# EAGLE design xbee_inclinometer (EAGLE 9.6.2)
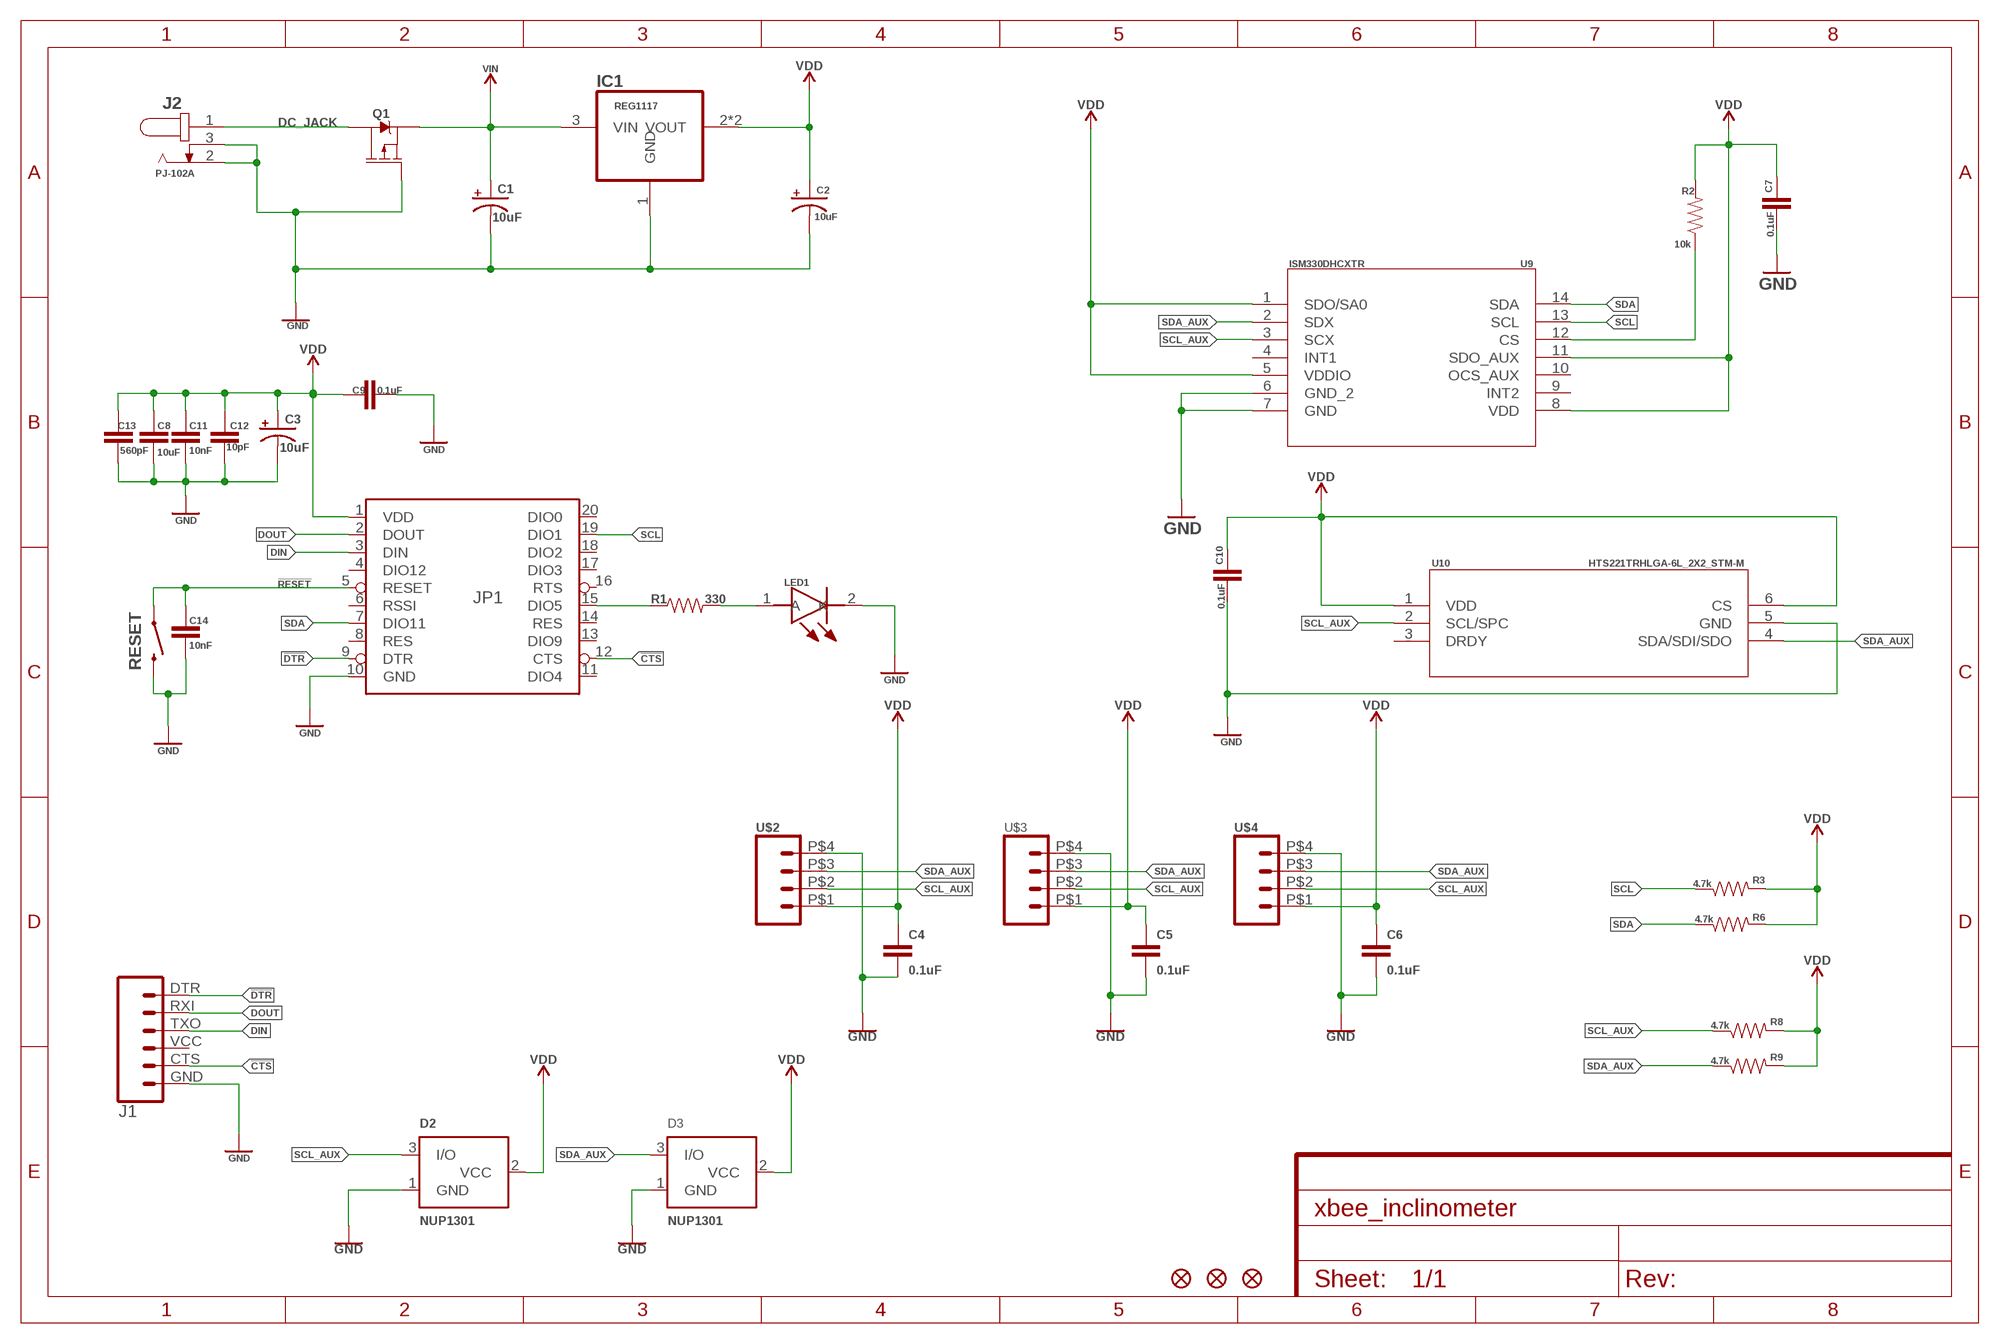
[diagram p0: schematic, sheet 1]

## Parts
C1  10uF  10UF-POLAR-EIA3216-16V-10%(TANT)  [EIA3216]
C2  10uF  10UF-POLAR-EIA3216-16V-10%(TANT)  [EIA3216]
C3  10uF  10UF-POLAR-EIA3216-16V-10%(TANT)  [EIA3216]
C4  0.1uF  0.1UF-0603-25V-(+80/-20%)  [0603]
C5  0.1uF  0.1UF-0603-25V-(+80/-20%)  [0603]
C6  0.1uF  0.1UF-0603-25V-(+80/-20%)  [0603]
C7  0.1uF  0.1UF-0603-25V-(+80/-20%)  [0603]
C8  10uF  10UF-0603-6.3V-20%  [0603]
C9  0.1uF  0.1UF-0603-25V-(+80/-20%)  [0603]
C10  0.1uF  0.1UF-0603-25V-(+80/-20%)  [0603]
C11  10nF  10NF-0603-50V-10%  [0603]
C12  10pF  10PF-0603-50V-5%  [0603]
C13  560pF  560PF-0603-50V-5%  [0603]
C14  10nF  10NF-0603-50V-10%  [0603]
D2  NUP1301  NUP1301_NUP1301  [NUP1301_SOT-23]
D3  NUP1301  NUP1301_NUP1301  [NUP1301_SOT-23]
FID1  MICROBUILDER_FIDUCIAL""  [MICROBUILDER_FIDUCIAL_1MM]
FID2  MICROBUILDER_FIDUCIAL""  [MICROBUILDER_FIDUCIAL_1MM]
FID4  MICROBUILDER_FIDUCIAL""  [MICROBUILDER_FIDUCIAL_1MM]
IC1  REG1117  [SOT223]
J1  6_PIN_SERIAL_CABLEPTH  [FTDI_BASIC]
J2  PJ-102A  [CUI_PJ-102A]
JP1  XBEESMD  [XBEE-SMD]
LED1  SMTL2-UWD  [SMTL2UWD]
Q1  2.5A/30V/105mΩ  MOSFET_PCH-DMG2307L  [SOT23-3]
R1  330  330OHM-0603-1/10W-1%  [0603]
R2  10k  10KOHM-0603-1/10W-1%  [0603]
R3  4.7k  4.7KOHM-0603-1/10W-1%  [0603]
R6  4.7k  4.7KOHM-0603-1/10W-1%  [0603]
R8  4.7k  4.7KOHM-0603-1/10W-1%  [0603]
R9  4.7k  4.7KOHM-0603-1/10W-1%  [0603]
RESET  MOMENTARY-SWITCH-SPST-PTH-6.0MM  [TACTILE_SWITCH_PTH_6.0MM]
U9  ISM330DHCXTR  [QFN_DHCXTR_STM]
U10  HTS221TRHLGA-6L_2X2_STM-M  [HLGA-6L_2X2_STM-M]
U$2  RIGHT_ANGLED_DCFRECONN  [M8_FRECONN]
U$3  RIGHT_ANGLED_DCFRECONN  [M8_FRECONN]
U$4  RIGHT_ANGLED_DCFRECONN  [M8_FRECONN]

## Nets
!CTS: J1.CTS JP1.12(CTS)
!DTR: J1.DTR JP1.9(DTR)
!RESET: C14.1 JP1.5(RESET) RESET.1
DC_JACK: J2.1 Q1.3(D)
DIN: J1.TXO JP1.3(DIN)
DOUT: J1.RXI JP1.2(DOUT)
GND: C1.- C2.- C3.- C4.2 C5.2 C6.2 C7.2 C8.2 C9.1 C10.2 C11.2 C12.2 C13.2 C14.2 D2.1(GND) D3.1(GND) IC1.1(GND) J1.GND J2.2 J2.3 JP1.10(GND) LED1.2(K) Q1.1(G) RESET.3 U9.6(GND_2) U9.7(GND) U10.5(GND) U$2.P$4(GND) U$3.P$4(GND) U$4.P$4(GND)
N$1: JP1.15(DIO5) R1.1
N$3: LED1.1(A) R1.2
N$5: R2.1 U9.12(CS)
SCL: JP1.19(DIO1) R3.1 U9.13(SCL)
SCL_AUX: D2.3(I/O) R8.1 U9.3(SCX) U10.2(SCL/SPC) U$2.P$2(SCL) U$3.P$2(SCL) U$4.P$2(SCL)
SDA: JP1.7(DIO11) R6.1 U9.14(SDA)
SDA_AUX: D3.3(I/O) R9.1 U9.2(SDX) U10.4(SDA/SDI/SDO) U$2.P$3(SDA) U$3.P$3(SDA) U$4.P$3(SDA)
VDD: C2.+ C3.+ C4.1 C5.1 C6.1 C7.1 C8.1 C9.2 C10.1 C11.1 C12.1 C13.1 D2.2(VCC) D3.2(VCC) IC1.2(VOUT) IC1.4(VOUT) JP1.1(VDD) R2.2 R3.2 R6.2 R8.2 R9.2 U9.1(SDO/SA0) U9.5(VDDIO) U9.8(VDD) U9.11(SDO_AUX) U10.1(VDD) U10.6(CS) U$2.P$1(VCC) U$3.P$1(VCC) U$4.P$1(VCC)
VIN: C1.+ IC1.3(VIN) Q1.2(S)
Unconnected: J1.VCC JP1.4(DIO12) JP1.6(RSSI) JP1.8(RES) JP1.11(DIO4) JP1.13(DIO9) JP1.14(RES) JP1.16(RTS) JP1.17(DIO3) JP1.18(DIO2) JP1.20(DIO0) U9.4(INT1) U9.9(INT2) U9.10(OCS_AUX) U10.3(DRDY)

## Library data of the parts
C1-C3 = SparkFun-Capacitors:10UF-POLAR: 10.0µF polarized capacitors A capacitor is a passive two-terminal electrical component used to store electrical energy temporarily in an electric field.; PROD_ID: CAP-00811
C4-C7 C9 C10 = SparkFun-Capacitors:0.1UF: 0.1µF ceramic capacitors A capacitor is a passive two-terminal electrical component used to store electrical energy temporarily in an electric field.; PROD_ID: CAP-00810
C8 = SparkFun-Capacitors:10UF: 10.0µF ceramic capacitors A capacitor is a passive two-terminal electrical component used to store electrical energy temporarily in an electric field.; PROD_ID: CAP-11015
C11 C14 = SparkFun-Capacitors:10NF: 0.01uF/10nF/10,000pF ceramic capacitors A capacitor is a passive two-terminal electrical component used to store electrical energy temporarily in an electric field. CAP-09321; PROD_ID: CAP-00867
C12 = SparkFun-Capacitors:10PF: 10pF ceramic capacitors A capacitor is a passive two-terminal electrical component used to store electrical energy temporarily in an electric field.; PROD_ID: CAP-11812
C13 = SparkFun-Capacitors:560PF: 0.56nF/560pF ceramic capacitors A capacitor is a passive two-terminal electrical component used to store electrical energy temporarily in an electric field.; PROD_ID: CAP-08749
D2 D3 = NUP1301:NUP1301_NUP1301
FID1 FID2 FID4 = Adafruit TCA9548A:MICROBUILDER_FIDUCIAL: Fiducial Alignment Points Various fiducial points for machine vision alignment.; BOM: EXCLUDE
IC1 = burr-brown:REG1117: 800mA and 1A Low Dropout (LDO) Positive Regulator 1.8V, 2.5V, 2.85V, 3.3V, 5V, and Adj; MPN: REG1117; OC_FARNELL: 1097566; OC_NEWARK: 14P6981
J1 = SparkFun-Connectors:6_PIN_SERIAL_CABLE: 6-pin header connection for use with the "FTDI BASIC" pinout - CABLE SIDE. Also known as "Arduino Serial Program Header". This is used on a design to provide a 6-pin connection point for serial communication usually from a USB cable (D+/D-) to these headers (RX/TX). It also has the remaining pins necessary for programming in the Arduino evironment (DTR, GND, and sometimes VCC). Note, this device has "CABLE" in the name. It is intended to be used on a design that usually lives on the end of your USB cable and prvides the converter chip (FTDI232 or FTDI231x) to commnicate serial RX/TX. The "sister" device, named "TARGET" is inteneded to be used on a design that contains a target micro-controller that you wish to program. You can populate with some of these: Female Headers <https://www.sparkfun.com/products/115> (PRT-00115) For reference (or to suit your programming needs) check out these designs: SparkFun FTDI Basic Breakout - 5V <https://www.sparkfun.com/products/9716> (DEV-09716) SparkFun FTDI Basic Breakout - 3.3V <https://www.sparkfun.com/products/9873> (DEV-09873) SparkFun FTDI SmartBasic <https://www.sparkfun.com/products/12935> (DEV-12935) SparkFun Beefy 3 - FTDI Basic Breakout <https://www.sparkfun.com/products/13746> (DEV-13746)
J2 = PJ-102A:PJ-102A: 2.0 mm Center Pin, 2.5 A, Right Angle, Through Hole, Tapered Pins, Dc Power Jack Connector; MANUFACTURER: CUI INC; PART_REV: 1.03; STANDARD: Manufacturer recommendations
JP1 = SparkFun-RF:XBEE: Digi XBee and XBee Pro XBees are tiny blue chips that can communicate wirelessly with each other. They can do simple things, like replacing a couple of wires in serial communication, which is nice when you want to make a remote for your paintball vehicle. SparkFun Products SparkFun XBee Buying Guide <https://www.sparkfun.com/pages/xbee_guide> SparkFun XBee Explorer USB <https://www.sparkfun.com/products/11812> (WRL-11812) Breakout Board for XBee Module <https://www.sparkfun.com/products/8276> (WRL-8276) SparkFun XBee Explorer Regulated <https://www.sparkfun.com/products/11373> (WRL-11373) SparkFun XBee Explorer Dongle <https://www.sparkfun.com/products/11697> (WRL-11697) SparkFun XBee Shield <https://www.sparkfun.com/products/12847> (WRL-12847) SparkFun XBee Explorer Serial <https://www.sparkfun.com/products/13225> (WRL-13225); PROD_ID: CONN-09042
LED1 = SamacSys_Parts:SMTL2-UWD: Standard LEDs - SMD PLCC2 SMD TOP VIEW ULTRA WHITE 1800mcd Source: Datasheet <https://www.mouser.co.uk/datasheet/2/50/SMTL2-UWD-1285437.pdf>; DESCRIPTION: Standard LEDs - SMD PLCC2 SMD TOP VIEW ULTRA WHITE 1800mcd; HEIGHT: 2.254mm; MANUFACTURER_NAME: Califia; MANUFACTURER_PART_NUMBER: SMTL2-UWD; MOUSER_PART_NUMBER: 749-SMTL2-UWD; MOUSER_PRICE-STOCK: https://www.mouser.com/Search/Refine.aspx?Keyword=749-SMTL2-UWD
Q1 = SparkFun-DiscreteSemi:MOSFET_PCH: P-channel MOSFETs Voltage controlled devices that allow control of high current outputs. SparkFun Products: SparkFun ESP32 Thing <https://www.sparkfun.com/products/13907> SparkFun ESP8266 Thing <https://www.sparkfun.com/products/13231>; PROD_ID: TRANS-11308
R1 = SparkFun-Resistors:330OHM: 330Ω resistor A resistor is a passive two-terminal electrical component that implements electrical resistance as a circuit element. Resistors act to reduce current flow, and, at the same time, act to lower voltage levels within circuits. - Wikipedia; PROD_ID: RES-00818
R2 = SparkFun-Resistors:10KOHM: 10kΩ resistor A resistor is a passive two-terminal electrical component that implements electrical resistance as a circuit element. Resistors act to reduce current flow, and, at the same time, act to lower voltage levels within circuits. - Wikipedia; PROD_ID: RES-00824
R3 R6 R8 R9 = SparkFun-Resistors:4.7KOHM: 4.7kΩ resistor A resistor is a passive two-terminal electrical component that implements electrical resistance as a circuit element. Resistors act to reduce current flow, and, at the same time, act to lower voltage levels within circuits. - Wikipedia; PROD_ID: RES-07857
RESET = SparkFun-Switches:MOMENTARY-SWITCH-SPST: Momentary Switch (Pushbutton) - SPST Normally-open (NO) SPST momentary switches (buttons, pushbuttons). Variants PTH-12MM - 12mm square, through-hole Momentary Pushbutton Switch - 12mm Square <https://www.sparkfun.com/products/9190> (COM-09190) PTH-6.0MM, PTH-6.0MM-KIT - 6.0mm square, through-hole Mini Pushbutton Switch <https://www.sparkfun.com/products/97> (COM-00097) KIT package intended for soldering kit's - only one side of pads' copper is exposed. PTH-RIGHT-ANGLE-KIT - Right-angle, through-hole Right Angle Tactile Button <https://www.sparkfun.com/products/10791> - Used on SparkFun BigTime Watch Kit <https://www.sparkfun.com/products/11734> SMD-12MM - 12mm square, surface-mount Tactile Button - SMD (12mm) <https://www.sparkfun.com/products/12993> (COM-12993) Used on SparkFun PicoBoard <https://www.sparkfun.com/products/11888> SMD-4.5MM - 4.5mm Square Trackball Switch Used on SparkFun Blackberry Trackballer Breakout <https://www.sparkfun.com/products/13169> SMD-4.6MMX2.8MM - 4.60mm x 2.80mm, surface mount Used on SparkFun SAMD21 Mini Breakout <https://www.sparkfun.com/products/13664> SMD-5.2MM, SMD-5.2-REDUNDANT - 5.2mm square, surface-mount Mini Pushbutton Switch - SMD <https://www.sparkfun.com/products/8720> (COM-08720) Used on Arduino Pro Mini <https://www.sparkfun.com/products/11114> REDUNDANT package connects both switch circuits together SMD-6.0X3.5MM - 6.0 x 3.5mm, surface mount Momentary Reset Switch SMD <https://www.sparkfun.com/products/8229> (COM-08229) SMD-6.2MM-TALL - 6.2mm square, surface mount Tactile Button - SMD (6mm) <https://www.sparkfun.com/products/12992> Used on SparkFun Digital Sandbox <https://www.sparkfun.com/products/12651> SMD-RIGHT-ANGLE - Right-angle, surface mount Used on SparkFun Block for Intel® Edison - Arduino <https://www.sparkfun.com/products/13036>; PROD_ID: SWCH-08441; SF_SKU: COM-00097
U9 = ISM330DHCX:ISM330DHCXTR; BUILT_BY: EMA_Matt; COPYRIGHT: Copyright (C) 2018 Accelerated Designs. All rights reserved; DATASHEET: https://www.st.com/resource/en/datasheet/ism330dhcx.pdf; MANUFACTURER_PART_NUMBER: ISM330DHCXTR; SOURCELIBRARY: Add_to_database_2020-11-05; VENDOR: STMicroelectronics
U10 = HTS221:HTS221TR; BUILT_BY: EMA_Anthony; COPYRIGHT: Copyright (C) 2018 Accelerated Designs. All rights reserved; DATASHEET: https://www.st.com/content/ccc/resource/technical/document/datasheet/4d/9a/9c/ad/25/07/42/34/DM00116291.pdf/files/DM00116291.pdf/jcr:content/translations/en.DM00116291.pdf; MANUFACTURER_PART_NUMBER: HTS221TR; SOURCELIBRARY: Updates_to_database_2020-11-03; VENDOR: STMicroelectronics
U$2-U$4 = SparkFun-Connectors:RIGHT_ANGLED_DC

## Net classes
1 diff pairs: width 0.406 mm

## Board
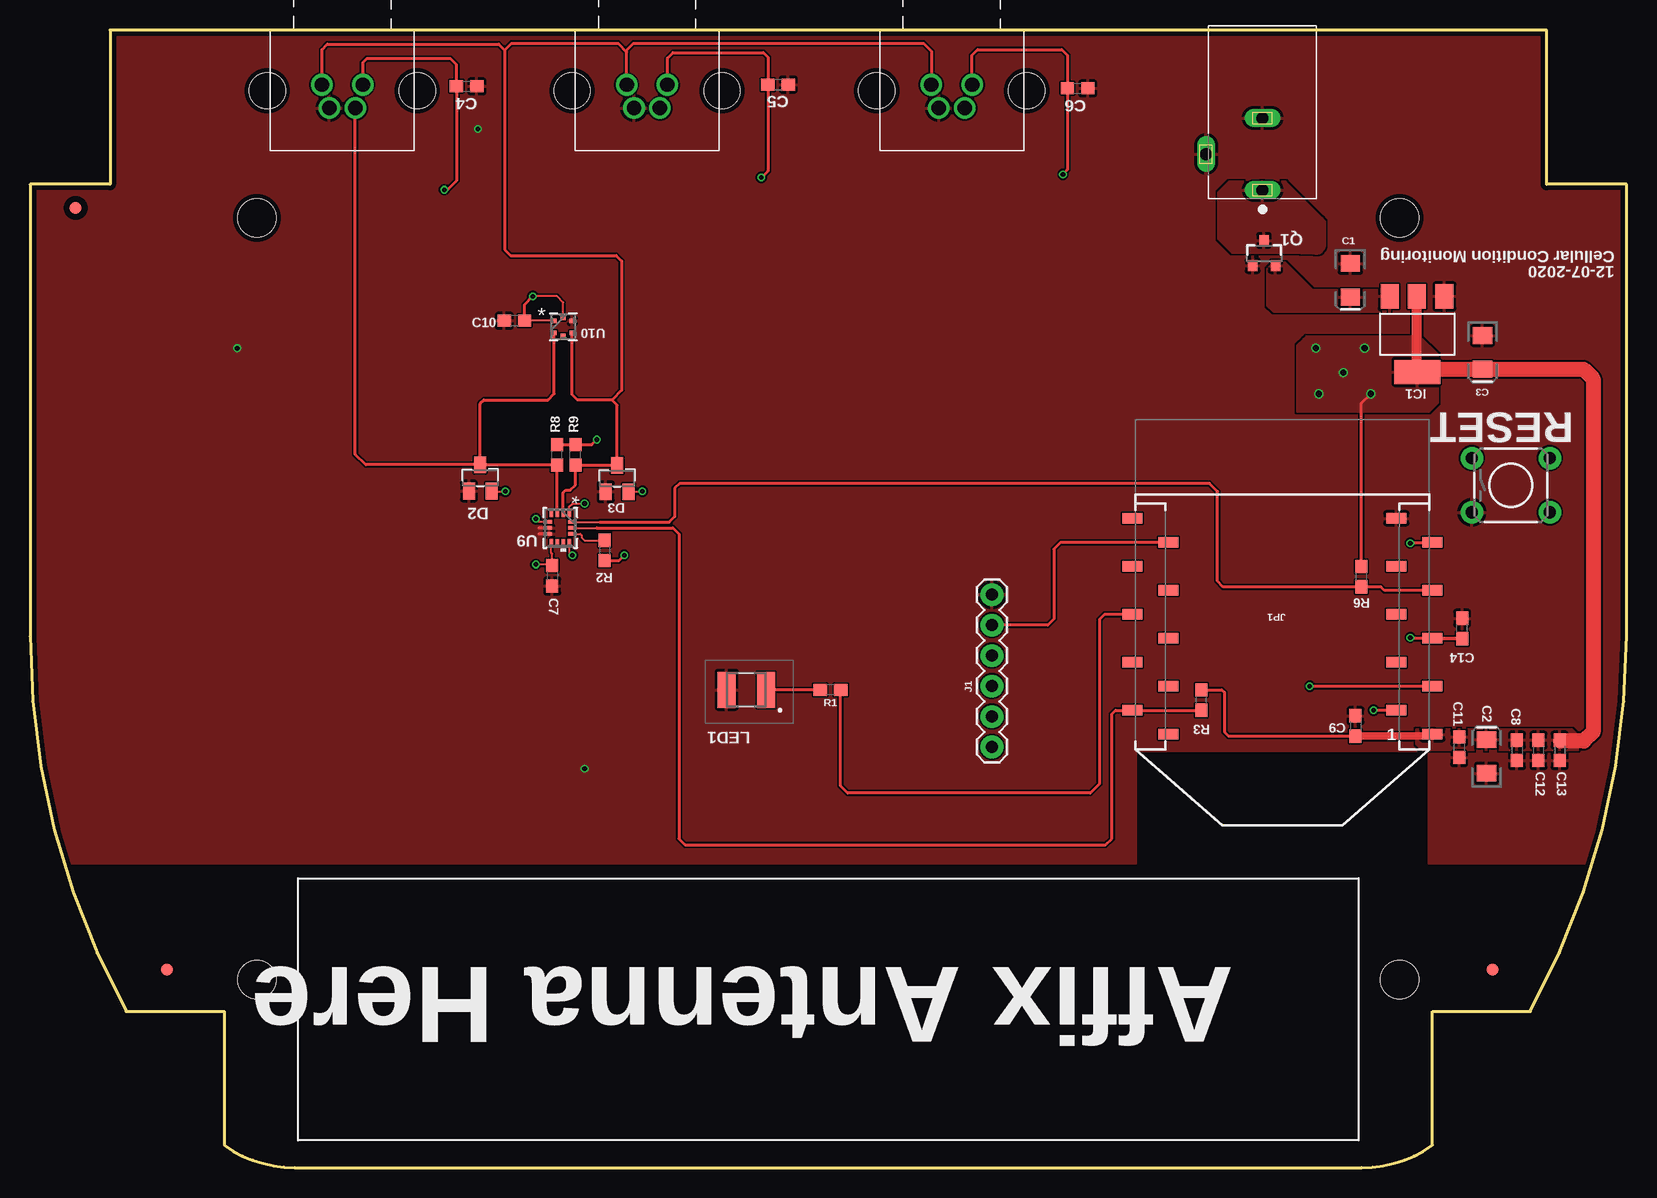
[diagram p1: board, top side]
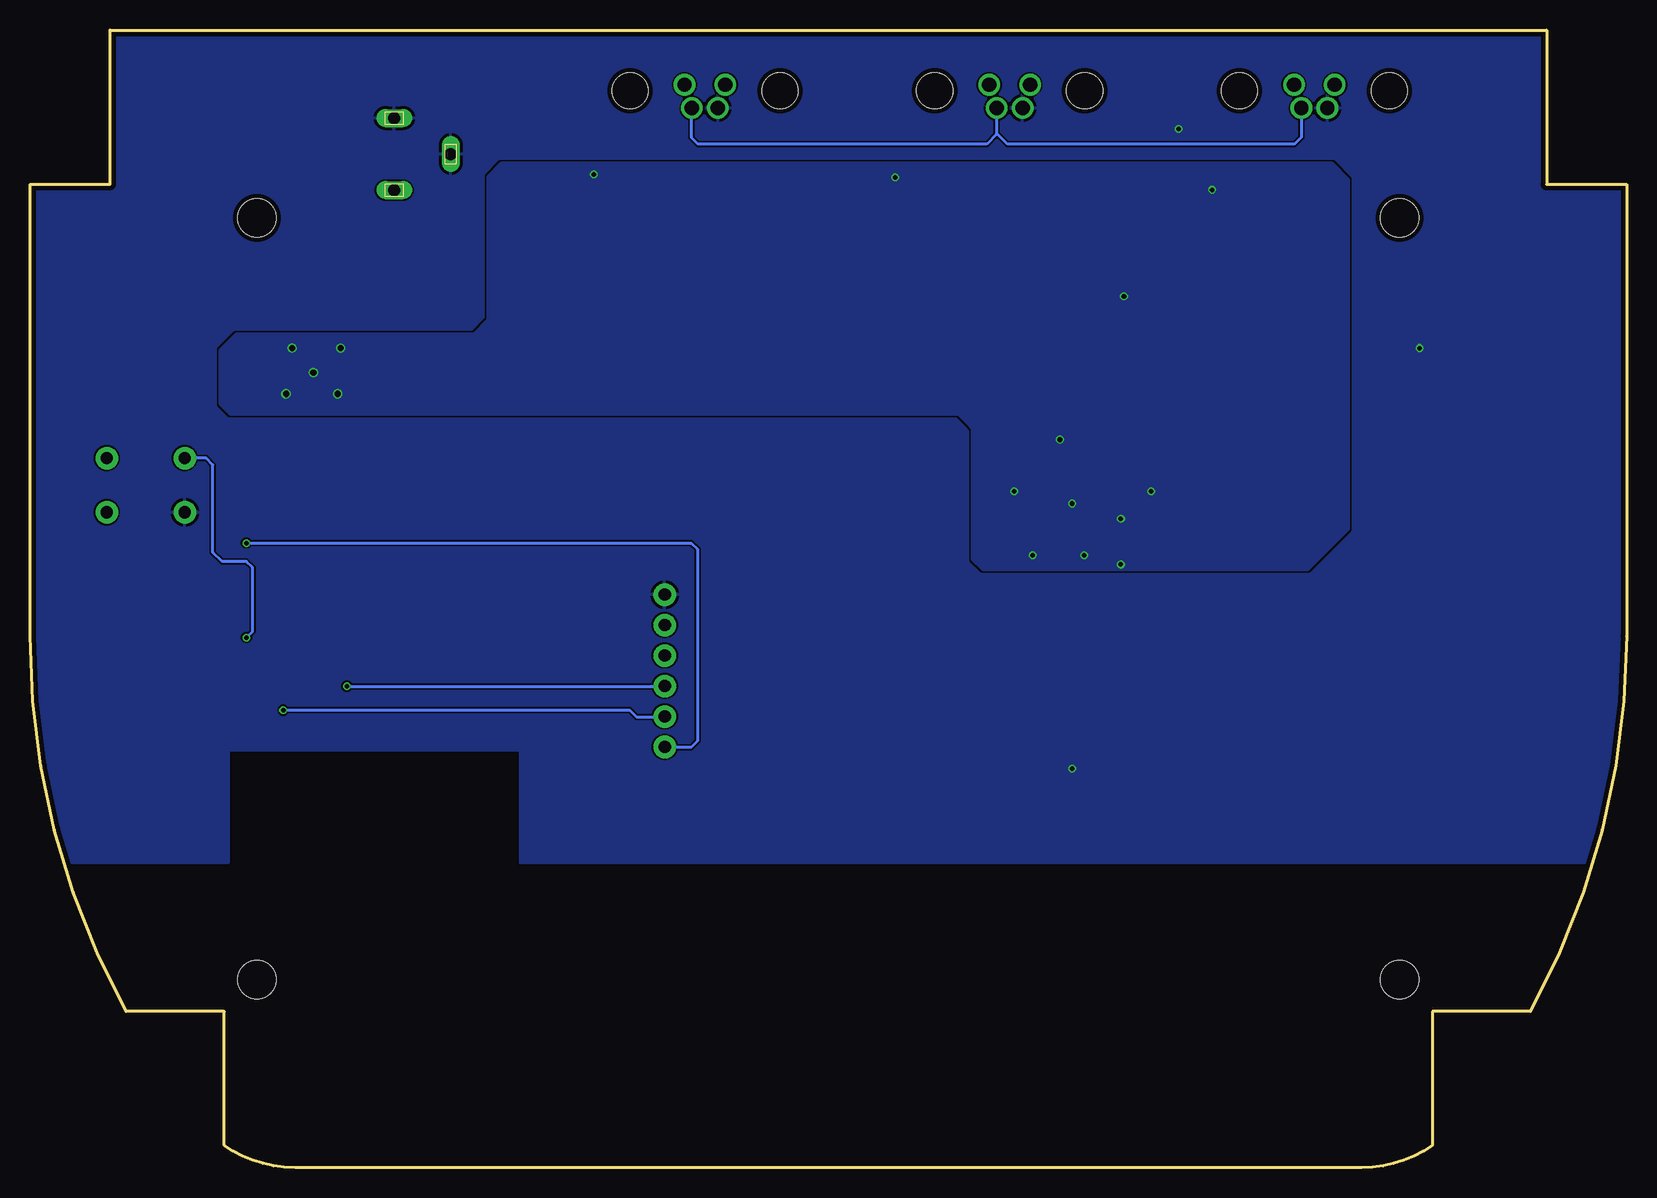
[diagram p2: board, bottom side, seen from below]

Size 133.1 x 94.85 mm. Coordinates in mm from the lower left corner, seen from the top.
Outline: 0,44.33 arc29 8.02,13.03 16.2,13.03 16.2,1.88 arc35 22.08,0 111.02,0 arc35 116.9,1.88 116.9,13.03 125.08,13.03 arc29 133.1,44.33 133.1,81.98 126.42,81.98 126.42,94.85 6.68,94.85 6.68,81.98 0,81.98 0,44.33
Copper layers (1*16): Top 0.035559375mm / dielectric 1.6mm / Bottom 0.035559375mm
Design rules "oshpark-2layer": minimum track width 6mil, minimum drill 10mil, track to track 6mil, track to pad 6mil, pad to pad 6mil, via to via 6mil, smd to smd 6mil, copper to edge 15mil, drill to drill 6mil, minimum pad ring 5mil, minimum via ring 5mil, stop-mask expansion 2.5mil, vias tented up to drill 0mil, thermal gap 10mil
Holes 3.18 mm at 114.17,79.18 18.92,15.68 18.92,79.18 114.17,15.68

### Footprints (pad centres in the part's own frame; a part is rotated, then mirrored left to right if it is on the bottom)
EIA3216 = smd 1.4 x 1.6: + 1.4,0; - -1.4,0
0603 = smd 1.1 x 1: 1 -0.85,0; 2 0.85,0
NUP1301_SOT-23 = smd 1 x 1.4: 1 -0.95,-1.1; 2 0.95,-1.1; 3 0,1.1
MICROBUILDER_FIDUCIAL_1MM = smd 1 x 1: 1 0,0
SOT223 = smd 1.499 x 2.007: 1 -2.261,-3.15; 2 0.025,-3.15; 3 2.311,-3.15 | smd 3.81 x 2.007: 4 0,3.15
FTDI_BASIC = drill 1.016 pad 1.88: CTS 10.16,0; DTR 0,0; GND 12.7,0; RXI 2.54,0; TXO 5.08,0; VCC 7.62,0
CUI_PJ-102A = drill 1 long: 1 -6.5,0; 2 -0.5,0; 3 -3.5,4.7
XBEE-SMD = smd 1.7 x 0.85: 1 -12.5,20; 2 -9.5,18; 3 -12.5,16; 4 -9.5,14; 5 -12.5,12; 6 -9.5,10; 7 -12.5,8; 8 -9.5,6; 9 -12.5,4; 10 -9.5,2; 11 12.5,2; 12 9.5,4; 13 12.5,6; 14 9.5,8; 15 12.5,10; 16 9.5,12; 17 12.5,14; 18 9.5,16; 19 12.5,18; 20 9.5,20
SMTL2UWD = smd 3 x 1.5: 1 0,-1.65; 2 0,1.65
SOT23-3 = smd 0.8 x 0.9: 1 -0.95,-1; 2 0.95,-1; 3 0,1.1
TACTILE_SWITCH_PTH_6.0MM = drill 1.016 pad 1.88: 1 -3.251,2.261; 2 3.251,2.261; 3 -3.251,-2.261; 4 3.251,-2.261
QFN_DHCXTR_STM = smd 0.533 x 0.305: 1 -1.181,0.75; 2 -1.181,0.25; 3 -1.181,-0.25; 4 -1.181,-0.75; 8 1.181,-0.75; 9 1.181,-0.25; 10 1.181,0.25; 11 1.181,0.75 | smd 0.305 x 0.533: 5 -0.5,-0.933; 6 0,-0.933; 7 0.5,-0.933; 12 0.5,0.933; 13 0,0.933; 14 -0.5,0.933
HLGA-6L_2X2_STM-M = smd 0.406 x 0.406: 1 -0.749,0.5; 2 -0.749,-0.5; 3 0,-0.749; 4 0.749,-0.5; 5 0.749,0.5; 6 0,0.749
M8_FRECONN = drill 1.2 pad 1.676: P$1 -1.7,-0.5; P$2 -1.08,1.45; P$3 1.7,-0.5; P$4 1.08,1.45 | hole 3: -6.25,0; 6.25,0

### Placement (x,y rotation side)
C1  110.06,73.99 270 top
C2  121.41,34.29 90 top
C3  121.08,67.97 270 top
C4  36.4,90.14 0 top
C5  62.36,90.3 0 top
C6  87.33,89.99 0 top
C7  43.54,49.35 270 top
C8  123.95,34.8 270 top
C9  110.49,36.83 270 top
C10  40.39,70.61 180 top
C11  119.13,35.05 270 top
C12  125.73,34.8 270 top
C13  127.51,34.8 270 top
C14  119.38,44.96 90 top
D2  37.54,57.51 0 top
D3  48.95,57.45 0 top
FID1  3.81,80.01 0 top
FID2  11.43,16.51 0 top
FID4  121.92,16.51 0 top
IC1  115.65,69.49 180 top
J1  80.19,35.08 90 top
J2  102.73,88 90 top
JP1  104.39,56.13 180 top
LED1  59.72,39.84 90 top
Q1  102.87,76.2 0 top
R1  66.73,39.83 180 top
R2  47.88,51.46 270 top
R3  97.66,38.99 90 top
R6  111,49.28 90 top
R8  43.94,59.44 90 top
R9  45.47,59.44 90 top
RESET  123.44,56.9 0 top
U9  44.2,53.34 270 top
U10  44.45,70.1 0 top
U$2  76.83,89.79 180 top
U$3  51.44,89.79 180 top
U$4  26.04,89.79 180 top

### Tracks (layer width: path | path; a pad name or v marks a point on that pad's centre or on a via)
!CTS
  Top 0.254: JP1.12 85.92,52.13 85.34,51.56 85.34,45.74 84.84,45.24 J1.CTS
!DTR  (via drill 0.38)
  Top 0.254: JP1.9 116.83,52.07 v115.06,52.07
  Bottom 0.254: v115.06,52.07 77.98,52.07 77.47,51.56 77.47,35.56 77.98,35.05 80.16,35.05 J1.DTR
!RESET  (via drill 0.38)
  Top 0.254: JP1.5 115.12,44.13 v115.06,44.2 | JP1.5 119.38,44.13 119.41,44.11 | JP1.5 119.35,44.13 C14.1
  Bottom 0.254: v115.06,44.2 114.55,44.7 114.55,50.04 115.06,50.55 117.09,50.55 117.86,51.31 117.86,58.6 118.42,59.16 RESET.1
DC_JACK
  pour Top: 99.06,81.28 99.06,77.47 100.2,76.33 100.33,76.33 104.65,76.33 104.78,76.33 107.11,76.23 arc92 107.95,77.04 107.95,78.87 107.7,79.12 104.65,82.17 100.08,82.17 99.95,82.17
DIN  (via drill 0.38)
  Top 0.254: JP1.3 v106.68,40.13
  Bottom 0.254: v106.68,40.13 81.28,40.13 81.03,40.13 80.21,40.13 J1.TXO
DOUT  (via drill 0.38)
  Top 0.254: JP1.2 112,38.13 v111.99,38.15
  Bottom 0.254: v111.99,38.15 83.11,38.15 82.55,37.59 80.21,37.59 J1.RXI
GND  (via drill 0.38)
  Top 0.254: U9.7 42.42,52.83 | U9.6 42.42,53.34
  other vias: 17.27,68.33 37.34,86.61 46.23,33.27
  pour Top (rank 5): 0,25.4 92.2,25.4 92.2,34.8 116.59,34.8 116.59,25.4 146.05,25.4 146.05,96.52 0,96.52
  pour Bottom (rank 6): 0,25.4 92.2,25.4 92.2,34.8 116.59,34.8 116.59,25.4 146.05,25.4 146.05,96.52 0,96.52
N$1
  Top 0.254: JP1.15 89.57,46.13 89.15,45.72 89.15,32 88.39,31.24 68.15,31.24 67.56,31.83 67.56,39.81 R1.1
N$3
  Top 0.254: R1.2 61.39,39.83 LED1.1
N$5
  Top 0.152: U9.12 45.87,52.84 46,52.7 46,52.53 46.23,52.3 47.87,52.3 R2.1
SCL
  Top 0.152: U9.13 47.24,53.34
  Top 0.254: 47.24,53.34 53.59,53.34 54.1,52.83 54.1,27.43 54.61,26.92 89.66,26.92 90.17,27.43 90.17,37.82 90.48,38.13 JP1.19 R3.1
SCL_AUX
  Top 0.254: D2.3 37.56,58.59 R8.1 U9.3 | D2.3 37.54,63.7 37.85,64.01 43.18,64.01 43.7,64.53 U10.2 | D2.3 27.98,58.61 27.11,59.47 U$4.P$2
  Bottom 0.254: U$4.P$2 27.11,85.92 27.69,85.34 51.61,85.34 52.53,86.26 | 52.53,86.26 52.53,88.33 U$3.P$2 | 52.53,86.26 52.53,86.16 53.34,85.34 77.42,85.34 77.95,85.88 77.95,88.3 U$2.P$2
SDA
  Top 0.152: U9.14 47.48,53.84 47.5,53.82
  Top 0.254: JP1.7 112.9,48.13 112.61,48.43 R6.1 99.45,48.43 98.98,48.9 98.98,56.39 98.32,57.05 54.15,57.05 53.75,56.64 53.75,54.28 53.29,53.82 47.5,53.82 | 45.15,53.82 U9.14
SDA_AUX
  Top 0.254: U9.2 44.45,56.28 44.65,56.49 45.03,56.49 45.47,56.92 R9.1 48.91,58.59 D3.3 48.95,63.58 48.51,64.01 | U10.4 45.2,64.45 45.64,64.01 48.51,64.01 | U$4.P$3 24.34,93.22 24.79,93.67 39.06,93.67 39.57,93.17 | 48.51,64.01 49.33,64.82 49.33,75.59 48.87,76.05 40.08,76.05 39.57,76.56 39.57,93.17 | 39.57,93.17 40.13,93.73 49.02,93.73 49.73,93.01 | U$3.P$3 49.73,93.01 | 49.73,93.01 49.73,93.17 50.29,93.73 74.5,93.73 75.14,93.09 U$2.P$3
VDD  (via drill 0.38, 0.51)
  Top 0.152: 43.69,70.61 C10.1 | U9.8 43.43,52.15 43.43,51.28 43.54,51.18 C7.1 43.45,50.29 v42.16,50.29 | D2.2 38.51,56.39 v39.62,56.39 | D3.2 51.02,56.35 v51.05,56.39 | U9.11 44.96,52.15 44.96,51.31 v45.21,51.05 | U9.1 44.95,55.11 45.21,55.37 v46.23,55.37 | U9.5 42.43,53.84 v42.16,54.1 | U10.6 44.45,72.14 43.94,72.64 v41.91,72.64
  Top 0.254: C3.+ | 35.56,90.16 C4.1 | C4.1 35.55,82.28 34.8,81.53 v34.54,81.53 | U$3.P$1 53.13,92.5 53.59,92.96 61.14,92.96 61.52,92.58 C5.1 61.51,83.1 v60.96,82.55 | U$2.P$1 78.53,92.76 78.99,93.22 86,93.22 86.47,92.75 C6.1 86.47,83.22 86.11,82.86 v86.11,82.8 | U10.1 43.69,70.61 | C10.1 41.24,71.97 v41.91,72.64 | R8.2 R9.2 46.82,60.29 v47.24,60.71 | R6.2 111,63.75 v111.76,64.52 | R3.2 99.35,39.84 99.57,39.62 99.57,36.32 99.91,35.98 C9.2 | C4.1 35.55,91.96 35.05,92.46 28.07,92.46 27.73,92.12 U$4.P$1 | R2.2 49.09,50.61 v49.53,51.05
  Top 0.305: C5.1
  Top 0.61: C9.2 116.74,35.98 JP1.1
  Top 0.813: IC1.2 115.62,66.37 IC1.4 115.88,66.57 | 120.86,66.34 C3.+ | 127.52,35.64 C13.1 127.6,35.56 | C2.+ 121.2,35.9
  Top 1.27: 115.88,66.57 C3.+ | C3.+ 129.52,66.57 130.3,65.79 130.3,36.32 129.54,35.56 127.6,35.56
  other vias: 107.44,64.52 109.47,66.29 111.25,68.33 107.19,68.33
  pour Top: 115.57,36.58 128.52,36.58 129.03,36.07 129.03,34.8 116.08,34.8 115.57,35.31
  pour Bottom: 24.64,83.57 93.73,83.57 94.74,82.55 94.74,77.72 94.74,70.61 96.01,69.34 98.04,69.34 115.82,69.34 117.09,68.07 117.09,63.75 116.33,62.99 55.63,62.99 54.86,62.23 54.36,61.72 54.36,50.8 53.59,50.04 49.02,50.04 26.67,50.04 25.4,51.31 23.37,53.34 23.37,81.28 23.37,82.3
  pour Top: 105.66,62.99 105.66,68.58 106.17,69.09 106.43,69.34 115.06,69.34 115.82,69.34 117.35,67.82 117.35,63.75 117.09,63.5 116.59,62.99
VIN
  pour Top: 113.79,73.15 106.93,73.15 104.65,75.44 103.63,75.44 103.38,75.18 103.12,74.93 103.12,74.17 103.12,71.88 103.63,71.37 113.79,71.37 114.05,71.63 114.05,72.9

### Text on the board
tPlace: Cellular Condition Monitoring | 12-07-2020
tNames: Affix Antenna Here